# EAGLE design M5StickC_Access_Switch_Input (EAGLE 9.6.2)
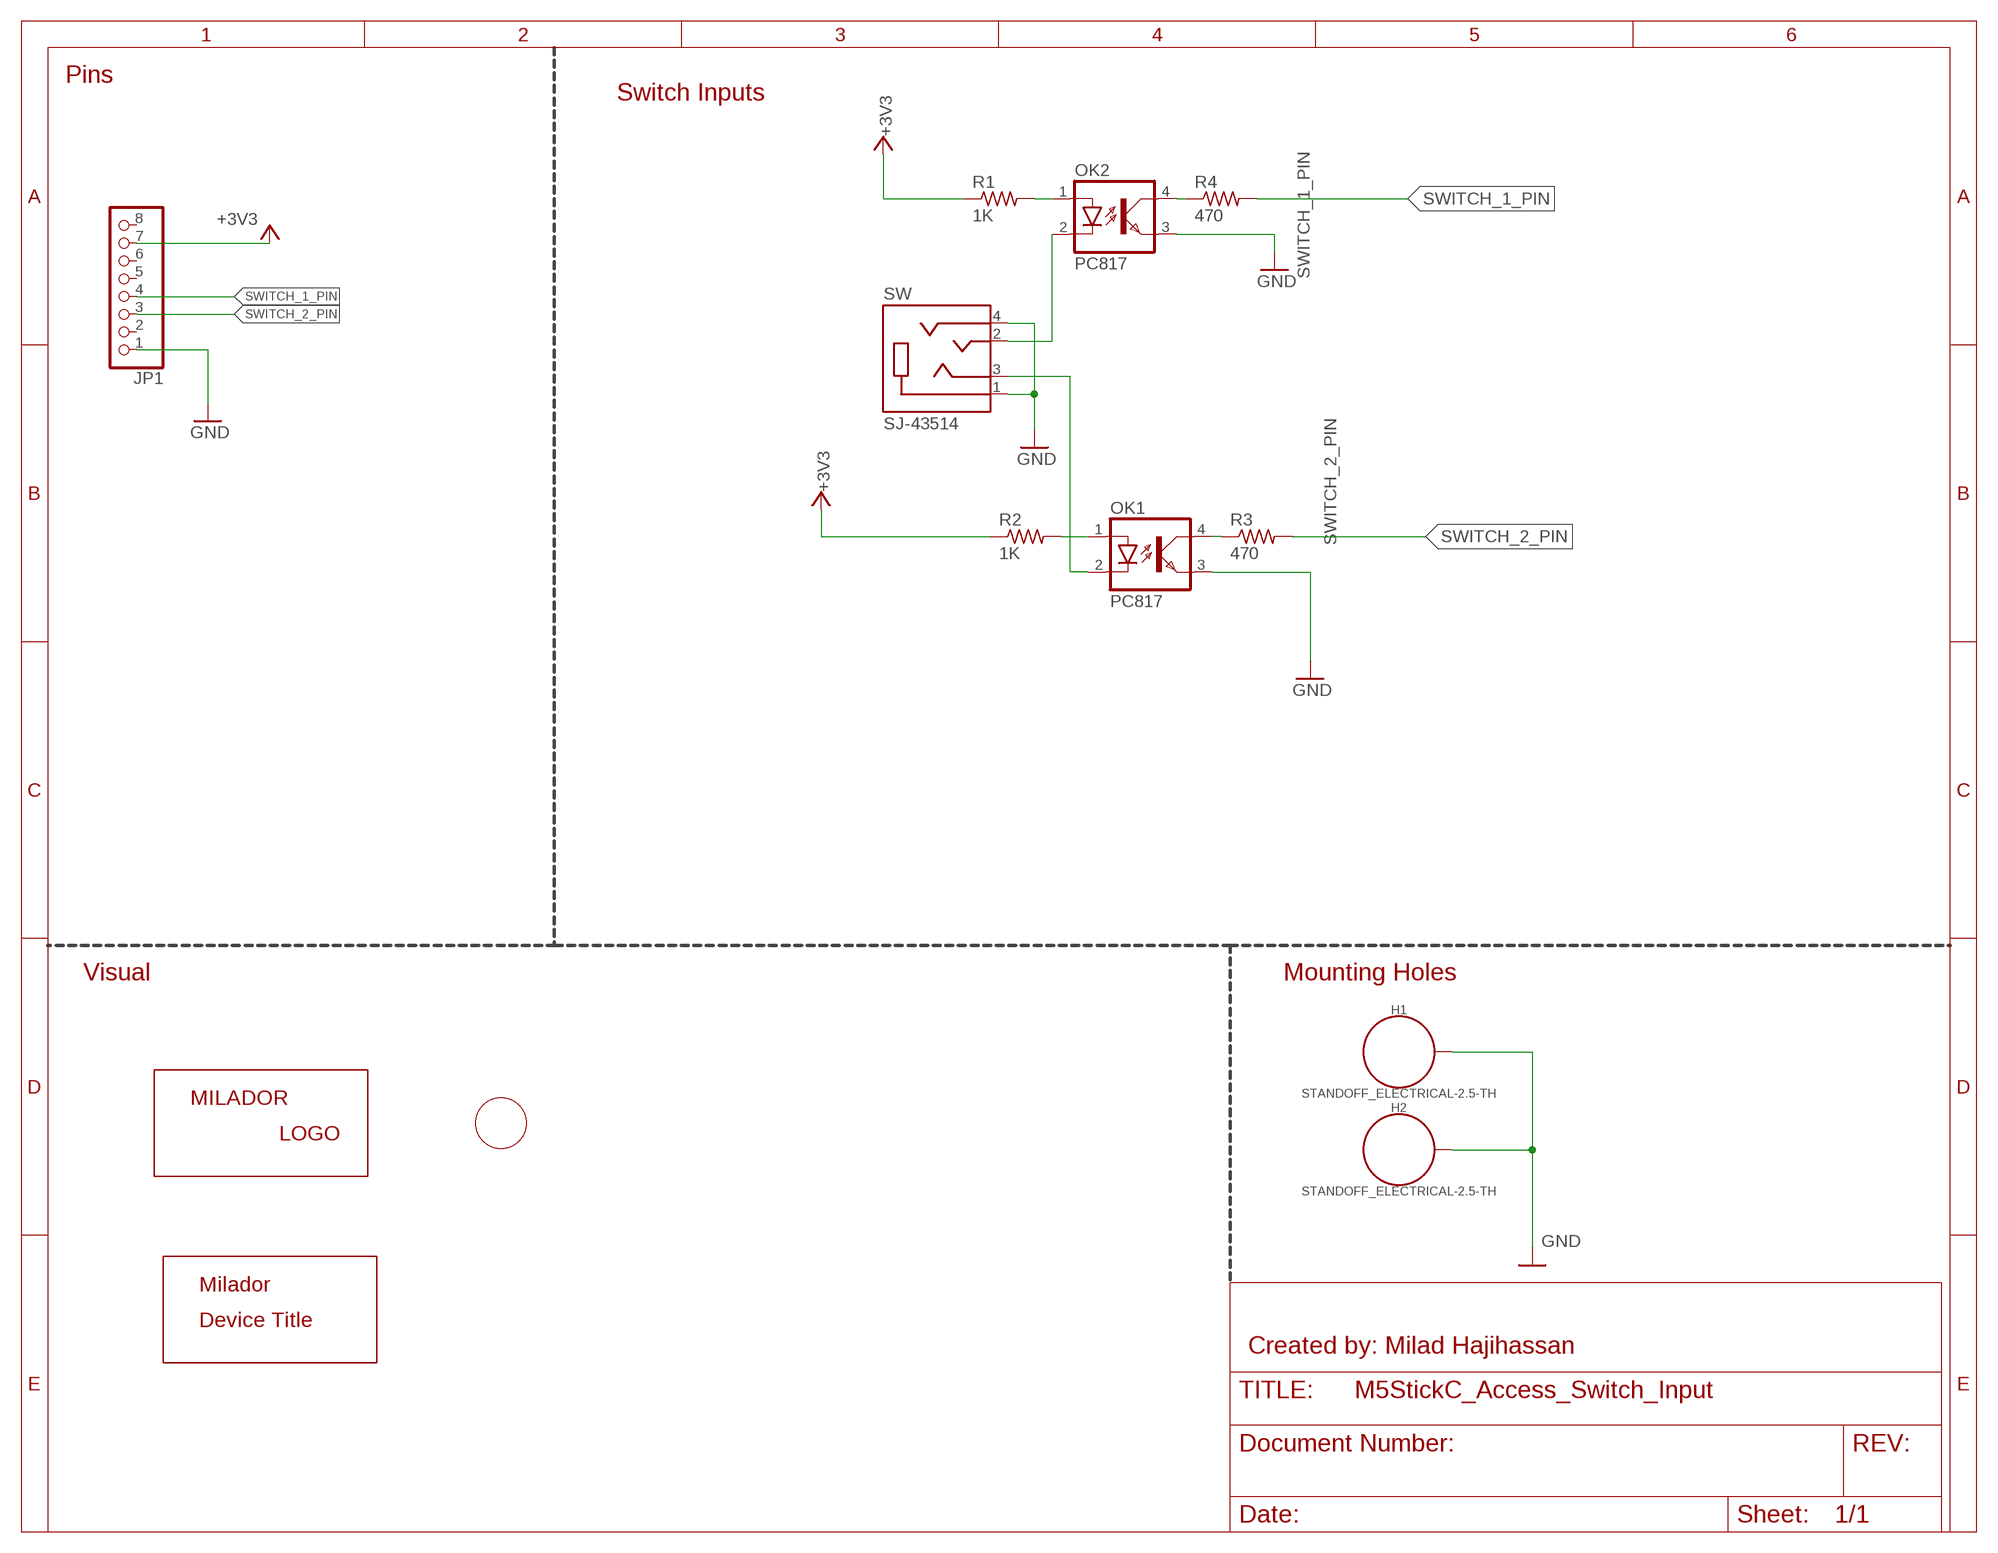
[diagram p0: schematic, sheet 1]

## Parts
H1  STANDOFF_ELECTRICAL-2.5-TH  [STANDOFF-ELECTRICAL-2.5-TH]
H2  STANDOFF_ELECTRICAL-2.5-TH  [STANDOFF-ELECTRICAL-2.5-TH]
JP1  HEADER_MALE-1X8ROUND-RA  [1X08_ROUND_RA]
LABEL_DEVICE_TOP  MILADOR-DEVICE-M5-ACCESS-SWITCH  [MILADOR_M5_ACCESS_SWITCH]
LABEL_INPUT_TOP  MILADOR-SWITCH-NAME-SW-INPUT  [SWITCH-INPUT]
LABEL_LOGO_TOP  MILADOR-LOGO-SM  [MILADOR_LOGO2]
OK1  PC817  [DIL04]
OK2  PC817  [DIL04]
R1  1K  RESISTOR-US-0204/5  [RESISTOR_0204/5]
R2  1K  RESISTOR-US-0204/5  [RESISTOR_0204/5]
R3  470  RESISTOR-US-0204/5  [RESISTOR_0204/5]
R4  470  RESISTOR-US-0204/5  [RESISTOR_0204/5]
SW  SJ-43514  [CUI_SJ-43514]

## Nets
+3V3: JP1.7 R1.1 R2.1
GND: H1.P1 H2.P1 JP1.1 OK1.3(EMIT) OK2.3(EMIT) SW.1(SLEEVE) SW.4(RING2)
N$1: OK1.1(A) R2.2
N$2: OK1.4(COL) R3.1
N$3: OK1.2(C) SW.3(RING1)
N$14: OK2.1(A) R1.2
N$20: OK2.4(COL) R4.1
N$23: OK2.2(C) SW.2(TIP)
SWITCH_1_PIN: JP1.4 R4.2
SWITCH_2_PIN: JP1.3 R3.2
Unconnected: JP1.2 JP1.5 JP1.6 JP1.8

## Notes on the sheet
- Pins
- Switch Inputs
- Visual | Mounting Holes
- Created by: Milad Hajihassan

## Library data of the parts
H1 H2 = milador:STANDOFF_ELECTRICAL: Stand Off Drill holes with an electrical connection. For example, use these to ground your board to a chassis. Example SparkFun Products Screw - Phillips Head (1/4", 4-40, 10 pack) <https://www.sparkfun.com/products/10453> (PRT-10453) Screw - Phillips Head (1/2", 4-40, 10 pack) <https://www.sparkfun.com/products/10452> (PRT-10452) Screw - Phillips Head (3/4", 4-40, 10 pack) <https://www.sparkfun.com/products/10451> (PRT-10451) Screw - Phillips Head (1", 4-40, 10 pack) <https://www.sparkfun.com/products/10450> (PRT-10450)
JP1 = milador:HEADER_MALE-1X8: PIN HEADER
LABEL_DEVICE_TOP = milador:MILADOR-DEVICE-
LABEL_INPUT_TOP = milador:MILADOR-SWITCH-NAME-
LABEL_LOGO_TOP = milador:MILADOR-LOGO-
OK1 OK2 = milador:PC817: SHARP OPTO COUPLER
R1-R4 = milador:RESISTOR-US-: RESISTOR, American symbol
SW = milador:SJ-43514

## Board
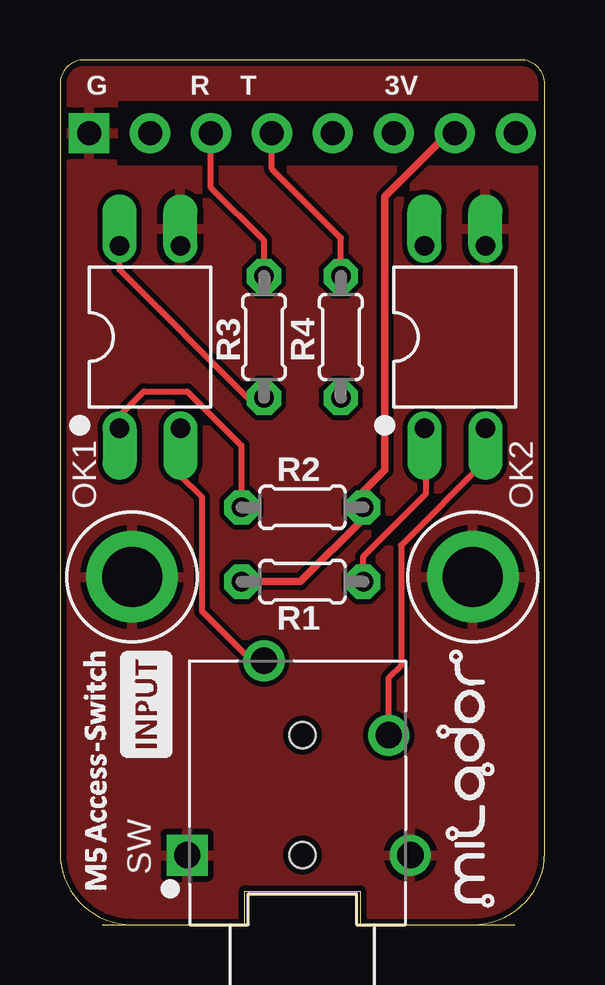
[diagram p1: board, top side]
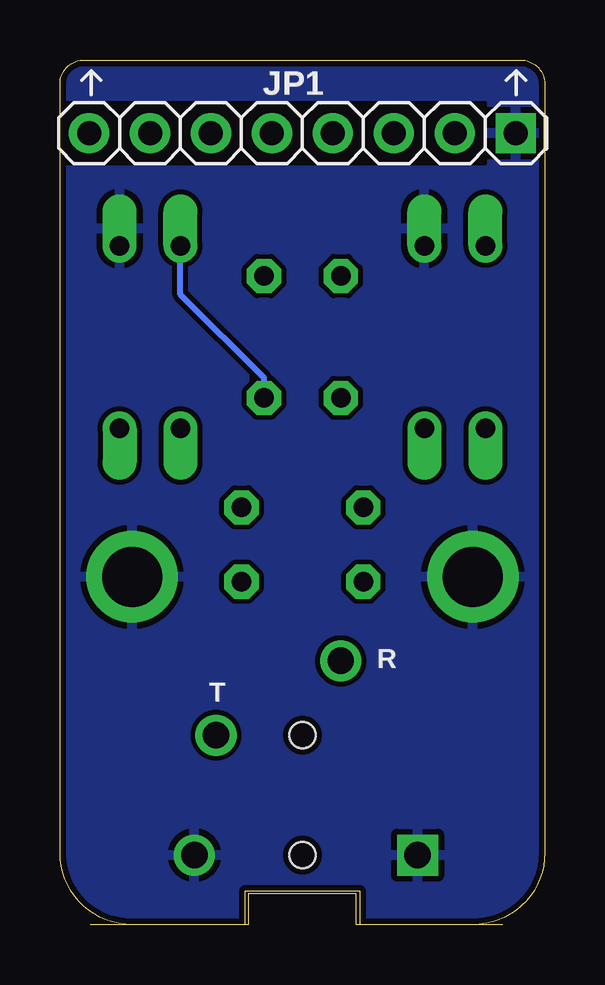
[diagram p2: board, bottom side, seen from below]

Size 20.2 x 36.05 mm. Coordinates in mm from the lower left corner, seen from the top.
Outline: 3,0 7.7,0 7.7,1.4 12.5,1.4 12.5,0 17.2,0 arc90 20.2,3 20.2,35.05 arc90 19.2,36.05 1,36.05 arc90 0,35.05 0,3 arc90 3,0
Copper layers (1*16): Top 0.035mm / dielectric 1.5mm / Bottom 0.035mm
Design rules "SparkFun": minimum track width 8mil, minimum drill 20mil, track to track 8mil, track to pad 8mil, pad to pad 8mil, via to via 8mil, smd to smd 8mil, copper to edge 10mil, drill to drill 8mil, minimum pad ring 12mil, minimum via ring 10mil, stop-mask expansion 4mil, vias tented up to drill 25mil, thermal gap 10mil

### Footprints (pad centres in the part's own frame; a part is rotated, then mirrored left to right if it is on the bottom)
STANDOFF-ELECTRICAL-2.5-TH = drill 2.5 pad 3.81: P1 0,0
1X08_ROUND_RA = drill 1 pad 1.676 square: 1 -8.89,0 | drill 1 pad 1.676: 2 -6.35,0; 3 -3.81,0; 4 -1.27,0; 5 1.27,0; 6 3.81,0; 7 6.35,0; 8 8.89,0
DIL04 = drill 0.813 offset: 1 -1.27,-3.81; 2 1.27,-3.81; 3 1.27,3.81; 4 -1.27,3.81
RESISTOR_0204/5 = drill 0.813 octagon: 1 -2.54,0; 2 2.54,0
CUI_SJ-43514 = drill 1.1 square: 1 -2.6,4.8 | drill 1.1: 2 2.4,-3.6; 3 5.5,1.6; 4 -2.6,-4.5 | hole 1.1: -2.6,0; 2.4,0

### Placement (x,y rotation side)
H1  3,14.5 0 top
H2  17.2,14.5 90 top
JP1  10.1,33 180 bottom
LABEL_DEVICE_TOP  1.6,6.4 90 top
LABEL_INPUT_TOP  3.6,9.2 90 top
LABEL_LOGO_TOP  17.4,5.4 90 top
OK1  3.75,24.5 0 top
OK2  16.45,24.5 0 top
R1  10.1,14.3 0 top
R2  10.1,17.4 180 top
R3  8.5,24.5 90 top
R4  11.7,24.5 90 top
SW  10.1,5.5 90 top

### Tracks (layer width: path | path; a pad name or v marks a point on that pad's centre or on a via)
+3V3
  Top 0.305: JP1.7 16.18,33 13.53,30.35 13.53,18.95 12.64,18.06 R2.1 12.64,16.92 10.02,14.3 R1.1
GND
  pour Bottom: 3,0 17.2,0 arc90 20.2,3 20.2,36.05 0,36.05 0,3 arc90
  pour Top: 3,0 17.2,0 arc90 20.2,3 20.2,36.05 0,36.05 0,3 arc90
  cutout Top: 2.48,31.72 2.48,34.27 20.2,34.27 20.2,31.73 2.44,31.73
  cutout Bottom: 2.48,34.27 20.2,34.27 20.2,31.73 2.48,31.73
N$1
  Top 0.254: OK1.1 2.48,21.22 3.5,22.24 5.3,22.24 7.56,19.98 R2.2
N$2
  Top 0.254: R3.1 7.83,21.96 2.48,27.31 OK1.4
N$3
  Top 0.254: SW.3 7.99,11 5.93,13.07 5.93,17.83 5.02,18.73 OK1.2
N$14
  Top 0.254: R1.2 12.64,15.36 15.24,17.95 15.24,19.87 15.18,19.93 OK2.1
N$20
  Bottom 0.254: R4.1 11.7,22.79 15.18,26.27 OK2.4
N$23
  Top 0.254: SW.2 13.7,10.31 14.21,10.81 14.21,15.81 17.72,19.32 OK2.2
SWITCH_1_PIN
  Top 0.254: R4.2 11.7,28.63 8.83,31.5 JP1.4
SWITCH_2_PIN
  Top 0.254: R3.2 8.5,28.52 6.29,30.73 JP1.3

### Text on the board
tPlace: G R T 3V
bPlace: R | T